# Altium schematic sheet surface.SchDoc
size A4
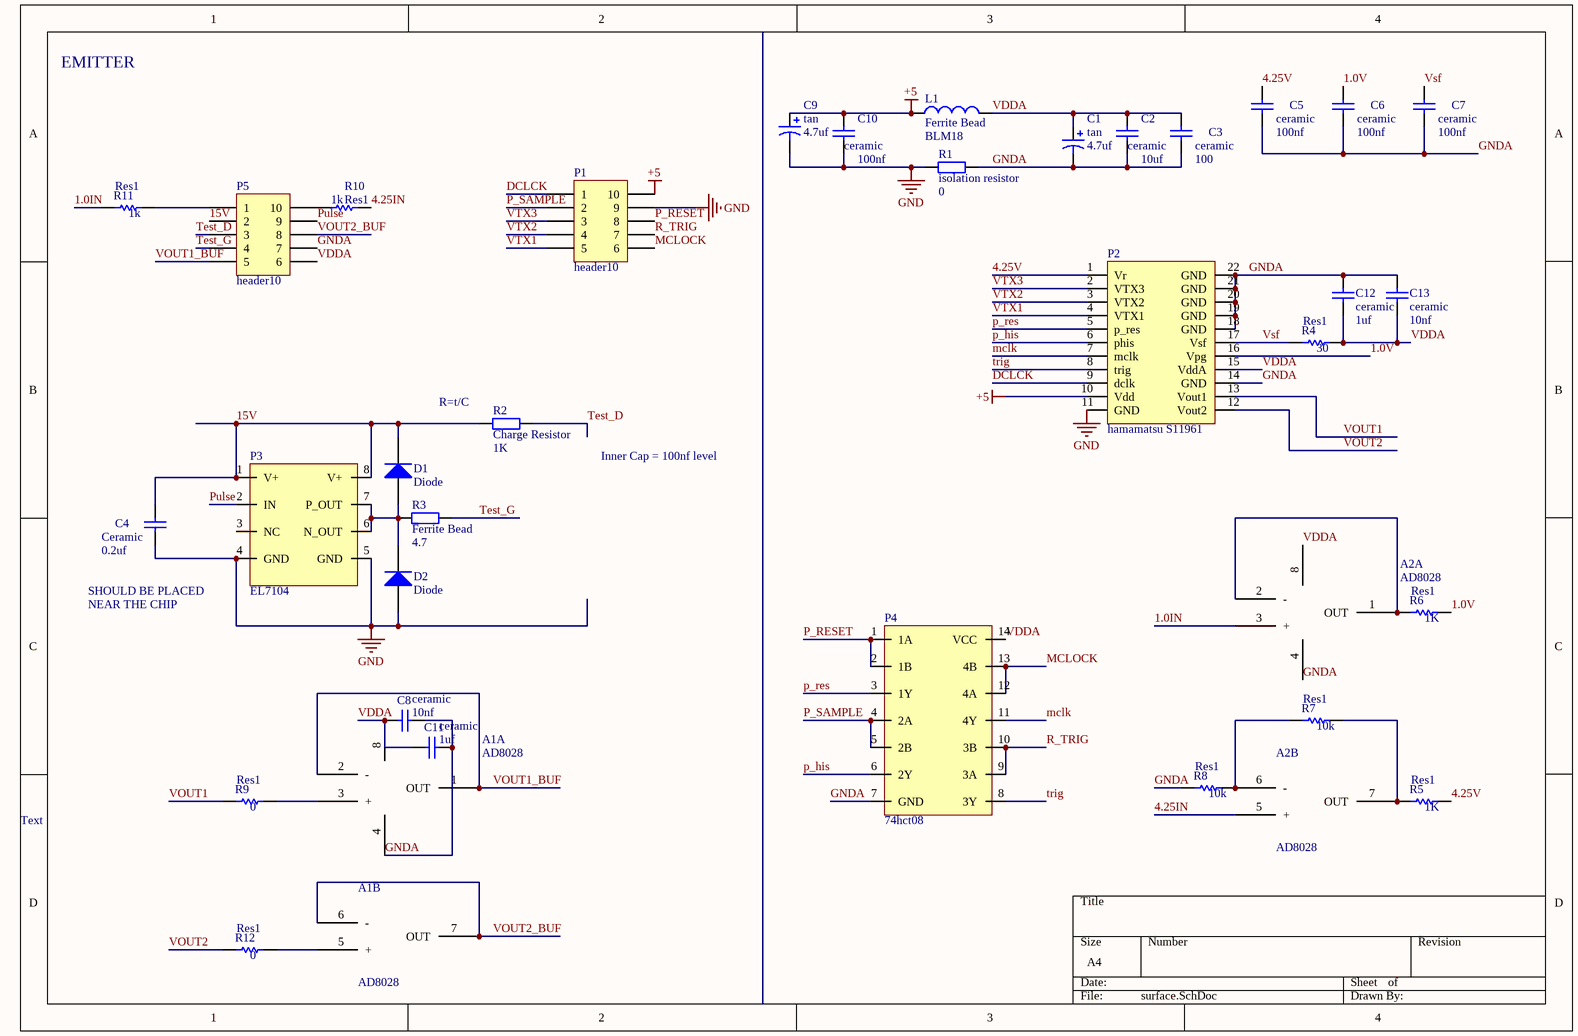
[diagram p0: surface.SchDoc]

## Parts
A1  AD8028  [so-8]  (parts A,B of 2)
A2  AD8028  [so-8]  (parts A,B of 2)
C1  tan  value 4.7uf  [C1206+]
C2  ceramic  value 10uf  [J1-0603]
C3  ceramic  value 100  [J1-0603]
C4  Ceramic  value 0.2uf  [J1-0603]
C5  ceramic  value 100nf  [J1-0603]
C6  ceramic  value 100nf  [J1-0603]
C7  ceramic  value 100nf  [J1-0603]
C8  ceramic  value 10nf  [J1-0603]
C9  tan  value 4.7uf  [C1206+]
C10  ceramic  value 100nf  [J1-0603]
C11  ceramic  value 1uf  [J1-0603]
C12  ceramic  value 1uf  [J1-0603]
C13  ceramic  value 10nf  [J1-0603]
D1  Diode  [DIODE]
D2  Diode  [DIODE]
L1  Ferrite Bead  value BLM18  [J1-0603]
P1  header10  [btb10p_f]
P2  hamamatsu S11961  [s11961]
P3  EL7104  [so-8]
P4  74hct08  [TSOP14]
P5  header10  [btb10p_f]
R1  isolation resistor  value 0  [J1-0603]
R2  Charge Resistor  value 1K  [2512]
R3  Ferrite Bead  value 4.7  [0805]
R4  Res1  value 30  [J1-0603]
R5  Res1  value 1K  [J1-0603]
R6  Res1  value 1K  [J1-0603]
R7  Res1  value 10k  [J1-0603]
R8  Res1  value 10k  [J1-0603]
R9  Res1  value 0  [J1-0603]
R10  Res1  value 1k  [J1-0603]
R11  Res1  value 1k  [J1-0603]
R12  Res1  value 0  [J1-0603]

## Nets
+5: C9.1 C10.2 L1.1 P1.10 P2.10(Vdd)
GND: C4.1 C9.2 C10.1 D2.1(A) P1.9 P2.11(GND) P3.4(GND) P3.5(GND) R1.1
1.0IN: A2.3(+) R11.1
1.0V: C6.2 P2.16(Vpg) R6.2
4.25IN: A2.5(+) R10.1
4.25V: C5.2 P2.1(Vr) R5.2
15V: C4.2 D1.2(K) P3.1(V+) P3.8(V+) P5.2 R2.1
DCLCK: P1.1 P2.9(dclk)
GNDA: A1.4 A2.4 C1.2 C2.1 C3.1 C5.1 C6.1 C7.1 C8.1 C11.1 C12.2 C13.1 P2.14(GND) P2.18(GND) P2.19(GND) P2.20(GND) P2.21(GND) P2.22(GND) P4.7(GND) P5.7 R1.2 R8.1
mclk: P2.7(mclk) P4.11(4Y)
MCLOCK: P1.6 P4.12(4A) P4.13(4B)
p_his: P2.6(phis) P4.6(2Y)
p_res: P2.5(p_res) P4.3(1Y)
P_RESET: P1.8 P4.1(1A) P4.2(1B)
P_SAMPLE: P1.2 P4.4(2A) P4.5(2B)
Pulse: P3.2(IN) P5.9
R_TRIG: P1.7 P4.9(3A) P4.10(3B)
Test_D: P5.3 R2.2
Test_G: P5.4 R3.2
trig: P2.8(trig) P4.8(3Y)
VDDA: A1.8 A2.8 C1.1 C2.2 C3.2 C8.2 C11.2 C12.1 C13.2 L1.2 P2.15(VddA) P4.14(VCC) P5.6 R4.2
VOUT1: P2.13(Vout1) R9.1
VOUT1_BUF: A1.1(OUT) A1.2(-) P5.5
VOUT2: P2.12(Vout2) R12.1
VOUT2_BUF: A1.6(-) A1.7(OUT) P5.8
Vsf: C7.2 P2.17(Vsf) R4.1
VTX1: P1.5 P2.4(VTX1)
VTX2: P1.4 P2.3(VTX2)
VTX3: P1.3 P2.2(VTX3)
NetA1_3: A1.3(+) R9.2
NetA1_5: A1.5(+) R12.2
NetA2_1: A2.1(OUT) A2.2(-) R6.1
NetA2_6: A2.6(-) R7.1 R8.2
NetA2_7: A2.7(OUT) R5.1 R7.2
NetD1_1: D1.1(A) D2.2(K) P3.6(N_OUT) P3.7(P_OUT) R3.1
NetP5_1: P5.1 R11.2
NetP5_10: P5.10 R10.2

Not connected (* = marked no-connect by the designer): P3 3(NC)

## Notes on the sheet
- EMITTER
- (near R2) R=t/C
- Inner Cap = 100nf level
- SHOULD BE PLACED
- NEAR THE CHIP
- Text

## Library data of the parts
C1 C9 = Cap Pol3: Polarized Capacitor (Surface Mount); Published: 8-Jun-2000; LatestRevisionDate: 29-May-2009; LatestRevisionNote: IPC-7351 Footprint Added.; PackageReference: C0805; Publisher: Altium Limited; PackageDescription: Chip Capacitor
C2-C8 C10-C13 = Cap: Capacitor; Published: 8-Jun-2000; LatestRevisionDate: 17-Jul-2002; LatestRevisionNote: Re-released for DXP Platform.; PackageReference: RAD-0.3; Publisher: Altium Limited; PackageDescription: Radial Cap, Thru-Hole; 2 Leads; 0.3 in Pin Spacing
D1 D2 = Diode: Default Diode; Published: 8-Jun-2000; LatestRevisionDate: 17-Jul-2002; LatestRevisionNote: Re-released for DXP Platform.; PackageVersion: Sep-1996; PackageReference: SMC; Publisher: Altium Limited; PackageDescription: DO-214-AB/SMC; 2 C-Bend Leads; Body 7.9 x 5.9 mm, inc. leads (LxW); Code_JEDEC: DO-214-AB
L1 = Inductor: Code_IEC: 1005; Published: 8-Jun-2000; LatestRevisionDate: 29-May-2009; LatestRevisionNote: IPC-7351 Footprint Added.; PackageReference: 0402-A; Publisher: Altium Limited; PackageDescription: Chip Inductor; Code_JEITA: 0402
P2 = S11961
P4 = 74alvc08
R1-R3 = Res2: Resistor; Published: 8-Jun-2000; LatestRevisionDate: 17-Jul-2002; LatestRevisionNote: Re-released for DXP Platform.; PackageReference: AXIAL-0.4; Publisher: Altium Limited; PackageDescription: Axial Device, Thru-Hole; 2 Leads; 0.4 in Pin Spacing
R4-R12 = Res1: Resistor; Published: 8-Jun-2000; LatestRevisionDate: 17-Jul-2002; LatestRevisionNote: Re-released for DXP Platform.; PackageReference: AXIAL-0.3; Publisher: Altium Limited; PackageDescription: Axial Device, Thru-Hole; 2 Leads; 0.3 in Pin Spacing